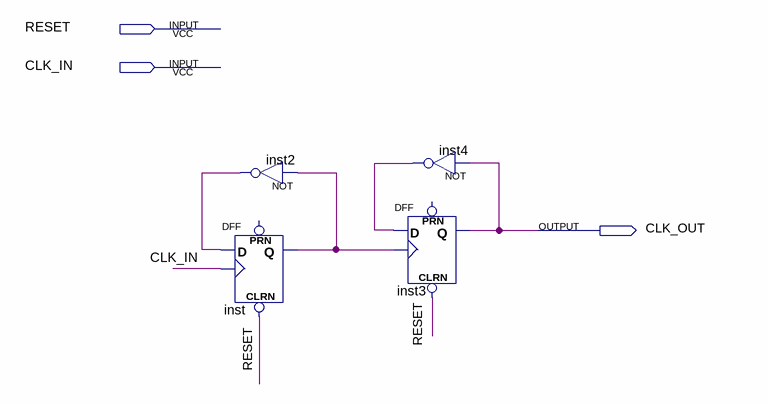
[diagram p0: schematic sheet]
// Quartus schematic div_freq2.bdf as structural Verilog: 4 symbols, 3 pins
module div_freq2 (
  input  RESET,
  input  CLK_IN,
  output CLK_OUT
);

  wire inst2_out, inst4_out, inst_q;

  not inst2 (inst2_out, inst_q);
  DFF inst (.CLRN(RESET), .CLK(CLK_IN), .D(inst2_out), .Q(inst_q));  // open: PRN
  not inst4 (inst4_out, CLK_OUT);
  DFF inst3 (.CLRN(RESET), .CLK(inst_q), .D(inst4_out), .Q(CLK_OUT));  // open: PRN
endmodule
